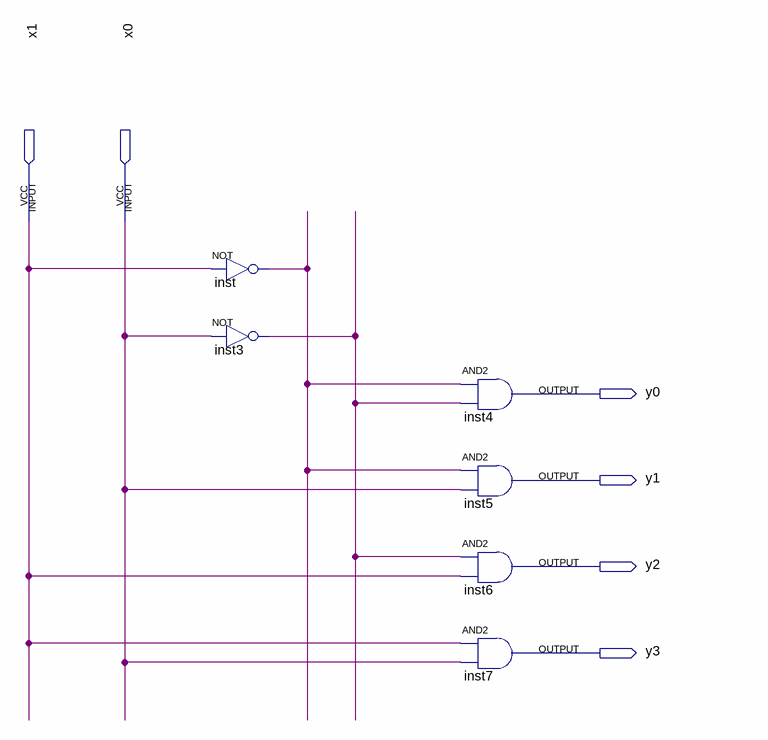
[diagram p0: schematic sheet]
// Quartus schematic lab1.bdf as structural Verilog: 6 symbols, 6 pins
module lab1 (
  input  x1,
  input  x0,
  output y0,
  output y1,
  output y2,
  output y3
);

  wire inst3_out, inst_out;

  not inst (inst_out, x1);
  not inst3 (inst3_out, x0);
  and inst4 (y0, inst_out, inst3_out);
  and inst5 (y1, inst_out, x0);
  and inst6 (y2, inst3_out, x1);
  and inst7 (y3, x1, x0);
endmodule
